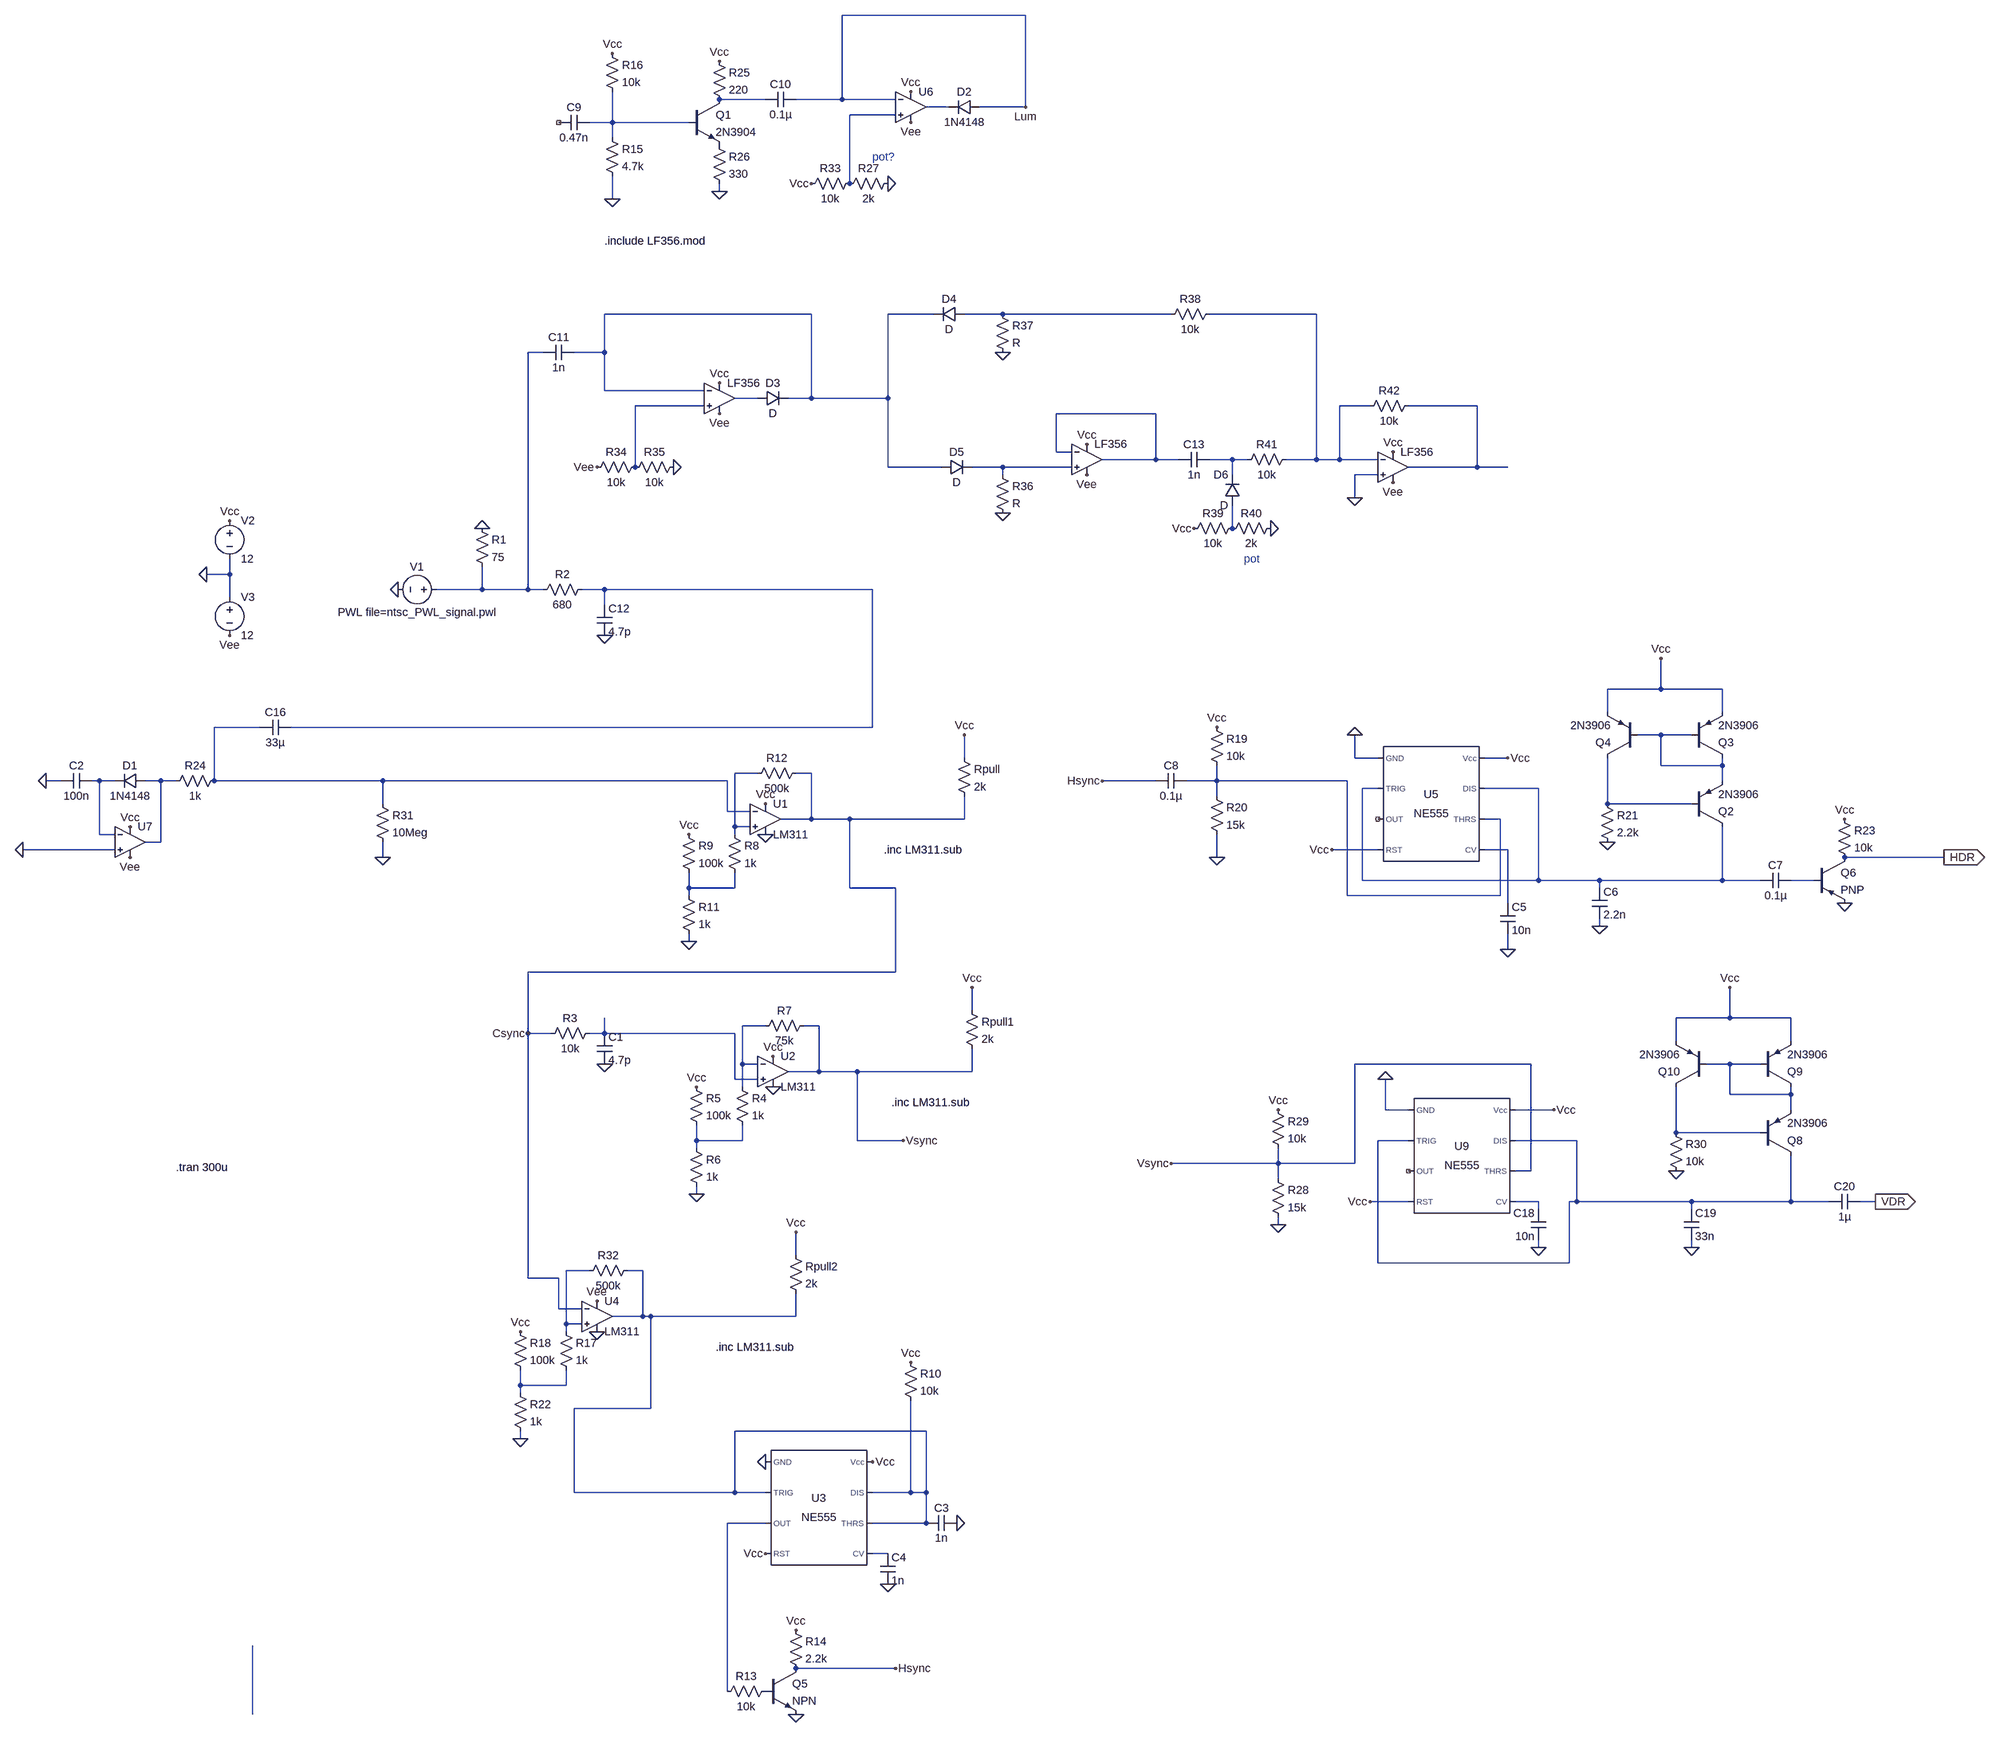
[diagram p0: schematic seventhCircuit(Sync and Ramp Semi finished).asc]
seventhCircuit(Sync and Ramp Semi finished).asc, the LTspice schematic file:
Version 4.1
SHEET 1 4812 2340
WIRE 1296 -1888 912 -1888
WIRE 752 -1712 656 -1712
WIRE 912 -1712 912 -1888
WIRE 912 -1712 816 -1712
WIRE 1024 -1712 912 -1712
WIRE 1136 -1696 1088 -1696
WIRE 1296 -1696 1296 -1888
WIRE 1296 -1696 1200 -1696
WIRE 1024 -1680 928 -1680
WIRE 432 -1664 432 -1728
WIRE 432 -1664 384 -1664
WIRE 592 -1664 432 -1664
WIRE 432 -1632 432 -1664
WIRE 928 -1536 928 -1680
WIRE 656 -1520 656 -1536
WIRE 432 -1504 432 -1552
WIRE 848 -768 416 -768
WIRE 1104 -768 1008 -768
WIRE 1248 -768 1168 -768
WIRE 1600 -768 1248 -768
WIRE 1904 -768 1680 -768
WIRE 288 -688 256 -688
WIRE 416 -688 416 -768
WIRE 416 -688 352 -688
WIRE 416 -608 416 -688
WIRE 624 -608 416 -608
WIRE 736 -592 688 -592
WIRE 848 -592 848 -768
WIRE 848 -592 800 -592
WIRE 1008 -592 1008 -768
WIRE 1008 -592 848 -592
WIRE 624 -576 480 -576
WIRE 2016 -576 1952 -576
WIRE 2240 -576 2096 -576
WIRE 1568 -560 1360 -560
WIRE 1360 -480 1360 -560
WIRE 1392 -480 1360 -480
WIRE 1568 -464 1568 -560
WIRE 1568 -464 1456 -464
WIRE 1616 -464 1568 -464
WIRE 1728 -464 1680 -464
WIRE 1760 -464 1728 -464
WIRE 1904 -464 1904 -768
WIRE 1904 -464 1840 -464
WIRE 1952 -464 1952 -576
WIRE 1952 -464 1904 -464
WIRE 2032 -464 1952 -464
WIRE 480 -448 480 -576
WIRE 1008 -448 1008 -592
WIRE 1120 -448 1008 -448
WIRE 1248 -448 1184 -448
WIRE 1392 -448 1248 -448
WIRE 2240 -448 2240 -576
WIRE 2240 -448 2096 -448
WIRE 2304 -448 2240 -448
WIRE 1248 -432 1248 -448
WIRE 1728 -432 1728 -464
WIRE 2032 -432 1984 -432
WIRE 1984 -384 1984 -432
WIRE 1728 -320 1728 -368
WIRE -368 -224 -368 -256
WIRE -368 -224 -416 -224
WIRE 160 -192 160 -240
WIRE 160 -192 64 -192
WIRE 256 -192 256 -688
WIRE 256 -192 160 -192
WIRE 288 -192 256 -192
WIRE 416 -192 368 -192
WIRE 976 -192 416 -192
WIRE -368 -176 -368 -224
WIRE 416 -160 416 -192
WIRE 2624 16 2624 -48
WIRE 2624 16 2512 16
WIRE 2752 16 2624 16
WIRE 2512 64 2512 16
WIRE 2752 64 2752 16
WIRE -304 96 -400 96
WIRE 976 96 976 -192
WIRE 976 96 -240 96
WIRE 2624 112 2576 112
WIRE 2688 112 2624 112
WIRE 1168 160 1168 112
WIRE 1984 160 1984 112
WIRE 2032 160 1984 160
WIRE 2304 160 2256 160
WIRE 2624 176 2624 112
WIRE 2752 176 2752 160
WIRE 2752 176 2624 176
WIRE 736 192 688 192
WIRE 848 192 816 192
WIRE -720 208 -752 208
WIRE -640 208 -656 208
WIRE -608 208 -640 208
WIRE -512 208 -544 208
WIRE -480 208 -512 208
WIRE -400 208 -400 96
WIRE -48 208 -400 208
WIRE 672 208 -48 208
WIRE 1568 208 1456 208
WIRE 1696 208 1696 176
WIRE 1696 208 1632 208
WIRE 1968 208 1696 208
WIRE 2752 208 2752 176
WIRE 2032 224 2000 224
WIRE 2368 224 2256 224
WIRE 1696 240 1696 208
WIRE -48 256 -48 208
WIRE 2512 256 2512 160
WIRE 2688 256 2512 256
WIRE 672 272 672 208
WIRE 720 272 672 272
WIRE 848 288 848 192
WIRE 848 288 784 288
WIRE 928 288 848 288
WIRE 1168 288 1168 240
WIRE 1168 288 928 288
WIRE 2288 288 2256 288
WIRE 688 304 688 192
WIRE 720 304 688 304
WIRE -640 320 -640 208
WIRE -608 320 -640 320
WIRE 688 320 688 304
WIRE -512 336 -512 208
WIRE -512 336 -544 336
WIRE -608 352 -800 352
WIRE 2032 352 1936 352
WIRE 2304 352 2256 352
WIRE -48 368 -48 336
WIRE 1696 368 1696 320
WIRE 3216 368 3008 368
WIRE 2000 416 2000 224
WIRE 2368 416 2368 224
WIRE 2368 416 2000 416
WIRE 2496 416 2368 416
WIRE 2752 416 2752 304
WIRE 2752 416 2496 416
WIRE 2832 416 2752 416
WIRE 2944 416 2896 416
WIRE 592 432 592 400
WIRE 688 432 688 400
WIRE 688 432 592 432
WIRE 928 432 928 288
WIRE 1024 432 928 432
WIRE 2496 432 2496 416
WIRE 592 448 592 432
WIRE 1968 448 1968 208
WIRE 2288 448 2288 288
WIRE 2288 448 1968 448
WIRE 2304 464 2304 352
WIRE 2496 512 2496 496
WIRE 592 544 592 528
WIRE 2304 560 2304 528
WIRE 1024 608 1024 432
WIRE 1024 608 256 608
WIRE 1184 688 1184 640
WIRE 2768 704 2768 640
WIRE 2768 704 2656 704
WIRE 2896 704 2768 704
WIRE 752 720 704 720
WIRE 864 720 832 720
WIRE 256 736 256 608
WIRE 304 736 256 736
WIRE 416 736 416 704
WIRE 416 736 384 736
WIRE 688 736 416 736
WIRE 2656 752 2656 704
WIRE 2896 752 2896 704
WIRE 704 800 704 720
WIRE 736 800 704 800
WIRE 2352 800 1984 800
WIRE 2768 800 2720 800
WIRE 2832 800 2768 800
WIRE 864 816 864 720
WIRE 864 816 800 816
WIRE 944 816 864 816
WIRE 1184 816 1184 768
WIRE 1184 816 944 816
WIRE 688 832 688 736
WIRE 736 832 688 832
WIRE 704 848 704 800
WIRE 2768 864 2768 800
WIRE 2896 864 2896 848
WIRE 2896 864 2768 864
WIRE 2048 896 2048 832
WIRE 2096 896 2048 896
WIRE 2400 896 2320 896
WIRE 2896 896 2896 864
WIRE 2656 944 2656 848
WIRE 2832 944 2656 944
WIRE 608 960 608 928
WIRE 704 960 704 928
WIRE 704 960 608 960
WIRE 944 960 944 816
WIRE 1040 960 944 960
WIRE 2096 960 2032 960
WIRE 2448 960 2320 960
WIRE 608 976 608 960
WIRE 1824 1008 1824 976
WIRE 1824 1008 1600 1008
WIRE 1984 1008 1984 800
WIRE 1984 1008 1824 1008
WIRE 2352 1024 2352 800
WIRE 2352 1024 2320 1024
WIRE 1824 1040 1824 1008
WIRE 608 1072 608 1056
WIRE 2096 1088 2016 1088
WIRE 2368 1088 2320 1088
WIRE 2448 1088 2448 960
WIRE 2448 1088 2432 1088
WIRE 2688 1088 2448 1088
WIRE 2896 1088 2896 992
WIRE 2896 1088 2688 1088
WIRE 2976 1088 2896 1088
WIRE 3072 1088 3040 1088
WIRE 2368 1104 2368 1088
WIRE 2688 1104 2688 1088
WIRE 1824 1136 1824 1120
WIRE 2368 1184 2368 1168
WIRE 2688 1184 2688 1168
WIRE 816 1200 816 1152
WIRE 2032 1216 2032 960
WIRE 2432 1216 2432 1088
WIRE 2432 1216 2032 1216
WIRE 384 1232 336 1232
WIRE 496 1232 464 1232
WIRE 256 1248 256 736
WIRE 320 1248 256 1248
WIRE 320 1312 320 1248
WIRE 368 1312 320 1312
WIRE 496 1328 496 1232
WIRE 496 1328 432 1328
WIRE 512 1328 496 1328
WIRE 816 1328 816 1280
WIRE 816 1328 512 1328
WIRE 336 1344 336 1232
WIRE 368 1344 336 1344
WIRE 336 1360 336 1344
WIRE 240 1472 240 1440
WIRE 336 1472 336 1440
WIRE 336 1472 240 1472
WIRE 240 1488 240 1472
WIRE 512 1520 512 1328
WIRE 512 1520 352 1520
WIRE 1088 1568 688 1568
WIRE 240 1584 240 1568
WIRE 352 1696 352 1520
WIRE 688 1696 688 1568
WIRE 688 1696 352 1696
WIRE 752 1696 688 1696
WIRE 1056 1696 1056 1504
WIRE 1056 1696 976 1696
WIRE 1088 1696 1088 1568
WIRE 1088 1696 1056 1696
WIRE 752 1760 672 1760
WIRE 1088 1760 1088 1696
WIRE 1088 1760 976 1760
WIRE 1008 1824 976 1824
WIRE 1024 2064 816 2064
WIRE 672 2112 672 1760
WIRE -320 2160 -320 2016
FLAG -16 -192 0
FLAG 160 -320 0
FLAG 1696 96 Vcc
FLAG 1696 368 0
FLAG 1984 112 0
FLAG 2304 560 0
FLAG 2496 512 0
FLAG 2512 336 0
FLAG 3216 368 HDR
IOPIN 3216 368 Out
FLAG 1456 208 Hsync
FLAG 416 -96 0
FLAG 592 544 0
FLAG 752 256 Vcc
FLAG -368 -336 Vcc
FLAG -368 -96 Vee
FLAG -416 -224 0
FLAG 2304 160 Vcc
FLAG 2624 -48 Vcc
FLAG 1936 352 Vcc
FLAG 1168 112 Vcc
FLAG 592 320 Vcc
FLAG 752 320 0
FLAG -48 368 0
FLAG 416 800 0
FLAG -752 208 0
FLAG -576 368 Vee
FLAG -576 304 Vcc
FLAG 608 1072 0
FLAG 768 784 Vcc
FLAG 1184 640 Vcc
FLAG 608 848 Vcc
FLAG 768 848 0
FLAG 1040 960 Vsync
FLAG 1824 1136 0
FLAG 1824 896 Vcc
FLAG 2400 896 Vcc
FLAG 2048 832 0
FLAG 2368 1184 0
FLAG 2016 1088 Vcc
FLAG 2656 1024 0
FLAG 2768 640 Vcc
FLAG 2688 1184 0
FLAG 3072 1088 VDR
IOPIN 3072 1088 Out
FLAG 1600 1008 Vsync
FLAG 240 1584 0
FLAG 400 1296 Vee
FLAG 816 1152 Vcc
FLAG 240 1360 Vcc
FLAG 400 1360 0
FLAG 256 736 Csync
FLAG 752 1632 0
FLAG 976 1632 Vcc
FLAG 752 1824 Vcc
FLAG 1152 1760 0
FLAG 1056 1424 Vcc
FLAG 1008 1888 0
FLAG 816 1984 Vcc
FLAG 816 2160 0
FLAG 1024 2064 Hsync
FLAG 3008 288 Vcc
FLAG 3008 464 0
FLAG 432 -1504 0
FLAG 656 -1792 Vcc
FLAG 656 -1520 0
FLAG 432 -1808 Vcc
FLAG 1056 -1664 Vee
FLAG 1056 -1728 Vcc
FLAG 848 -1536 Vcc
FLAG 1008 -1536 0
FLAG 1296 -1696 Lum
FLAG 656 -624 Vcc
FLAG 656 -560 Vee
FLAG 560 -448 0
FLAG 400 -448 Vee
FLAG 1248 -352 0
FLAG 1248 -688 0
FLAG 1424 -496 Vcc
FLAG 1424 -432 Vee
FLAG 1808 -320 0
FLAG 1648 -320 Vcc
FLAG 2064 -480 Vcc
FLAG 2064 -416 Vee
FLAG 1984 -384 0
FLAG -800 352 0
DATAFLAG 592 432 ""
DATAFLAG 608 960 ""
DATAFLAG 240 1472 ""
SYMBOL voltage 80 -192 R90
WINDOW 0 -32 56 VBottom 2
WINDOW 3 32 56 VTop 2
WINDOW 123 0 0 Left 0
WINDOW 39 0 0 Left 0
SYMATTR InstName V1
SYMATTR Value PWL file=ntsc_PWL_signal.pwl
SYMBOL res 144 -336 R0
SYMATTR InstName R1
SYMATTR Value 75
SYMBOL Misc\\NE555 2144 256 R0
SYMATTR InstName U5
SYMBOL res 1680 80 R0
SYMATTR InstName R19
SYMATTR Value 10k
SYMBOL res 1680 224 R0
SYMATTR InstName R20
SYMATTR Value 15k
SYMBOL cap 2288 464 R0
SYMATTR InstName C5
SYMATTR Value 10n
SYMBOL cap 2480 432 R0
SYMATTR InstName C6
SYMATTR Value 2.2n
SYMBOL cap 2896 400 R90
WINDOW 0 0 32 VBottom 2
WINDOW 3 32 32 VTop 2
SYMATTR InstName C7
SYMATTR Value 0.1µ
SYMBOL pnp 2688 304 M180
SYMATTR InstName Q2
SYMATTR Value 2N3906
SYMBOL pnp 2688 160 M180
SYMATTR InstName Q3
SYMATTR Value 2N3906
SYMBOL pnp 2576 160 R180
SYMATTR InstName Q4
SYMATTR Value 2N3906
SYMBOL res 2496 240 R0
SYMATTR InstName R21
SYMATTR Value 2.2k
SYMBOL cap 1632 192 R90
WINDOW 0 0 32 VBottom 2
WINDOW 3 32 32 VTop 2
SYMATTR InstName C8
SYMATTR Value 0.1µ
SYMBOL res 384 -208 R90
WINDOW 0 0 56 VBottom 2
WINDOW 3 32 56 VTop 2
SYMATTR InstName R2
SYMATTR Value 680
SYMBOL cap 400 -160 R0
SYMATTR InstName C12
SYMATTR Value 4.7p
SYMBOL res 672 304 R0
SYMATTR InstName R8
SYMATTR Value 1k
SYMBOL res 576 304 R0
SYMATTR InstName R9
SYMATTR Value 100k
SYMBOL res 576 432 R0
SYMATTR InstName R11
SYMATTR Value 1k
SYMBOL res 832 176 R90
WINDOW 0 0 56 VBottom 2
WINDOW 3 32 56 VTop 2
SYMATTR InstName R12
SYMATTR Value 500k
SYMBOL res 1152 144 R0
SYMATTR InstName Rpull
SYMATTR Value 2k
SYMBOL voltage -368 -352 R0
SYMATTR InstName V2
SYMATTR Value 12
SYMBOL voltage -368 -192 R0
SYMATTR InstName V3
SYMATTR Value 12
SYMBOL OpAmps\\opamp2 752 224 R0
SYMATTR InstName U1
SYMATTR Value LM311
SYMBOL res -64 240 R0
SYMATTR InstName R31
SYMATTR Value 10Meg
SYMBOL res 400 720 R90
WINDOW 0 0 56 VBottom 2
WINDOW 3 32 56 VTop 2
SYMATTR InstName R3
SYMATTR Value 10k
SYMBOL cap 400 736 R0
SYMATTR InstName C1
SYMATTR Value 4.7p
SYMBOL res -384 192 R90
WINDOW 0 0 56 VBottom 2
WINDOW 3 32 56 VTop 2
SYMATTR InstName R24
SYMATTR Value 1k
SYMBOL diode -544 192 R90
WINDOW 0 0 32 VBottom 2
WINDOW 3 32 32 VTop 2
SYMATTR InstName D1
SYMATTR Value 1N4148
SYMBOL cap -656 192 R90
WINDOW 0 0 32 VBottom 2
WINDOW 3 32 32 VTop 2
SYMATTR InstName C2
SYMATTR Value 100n
SYMBOL OpAmps\\UniversalOpAmp2 -576 336 R0
SYMATTR InstName U7
SYMBOL cap -240 80 R90
WINDOW 0 0 32 VBottom 2
WINDOW 3 32 32 VTop 2
SYMATTR InstName C16
SYMATTR Value 33µ
SYMBOL res 688 832 R0
SYMATTR InstName R4
SYMATTR Value 1k
SYMBOL res 592 832 R0
SYMATTR InstName R5
SYMATTR Value 100k
SYMBOL res 592 960 R0
SYMATTR InstName R6
SYMATTR Value 1k
SYMBOL res 848 704 R90
WINDOW 0 0 56 VBottom 2
WINDOW 3 32 56 VTop 2
SYMATTR InstName R7
SYMATTR Value 75k
SYMBOL res 1168 672 R0
SYMATTR InstName Rpull1
SYMATTR Value 2k
SYMBOL OpAmps\\opamp2 768 752 R0
SYMATTR InstName U2
SYMATTR Value LM311
SYMBOL res 1808 1024 R0
SYMATTR InstName R28
SYMATTR Value 15k
SYMBOL res 1808 880 R0
SYMATTR InstName R29
SYMATTR Value 10k
SYMBOL Misc\\NE555 2208 992 R0
SYMATTR InstName U9
SYMBOL cap 2384 1168 R180
WINDOW 0 24 56 Left 2
WINDOW 3 24 8 Left 2
SYMATTR InstName C18
SYMATTR Value 10n
SYMBOL pnp 2832 992 M180
SYMATTR InstName Q8
SYMATTR Value 2N3906
SYMBOL pnp 2832 848 M180
SYMATTR InstName Q9
SYMATTR Value 2N3906
SYMBOL pnp 2720 848 R180
SYMATTR InstName Q10
SYMATTR Value 2N3906
SYMBOL res 2640 928 R0
SYMATTR InstName R30
SYMATTR Value 10k
SYMBOL cap 2672 1104 R0
SYMATTR InstName C19
SYMATTR Value 33n
SYMBOL cap 3040 1072 R90
WINDOW 0 0 32 VBottom 2
WINDOW 3 32 32 VTop 2
SYMATTR InstName C20
SYMATTR Value 1µ
SYMBOL res 320 1344 R0
SYMATTR InstName R17
SYMATTR Value 1k
SYMBOL res 224 1344 R0
SYMATTR InstName R18
SYMATTR Value 100k
SYMBOL res 224 1472 R0
SYMATTR InstName R22
SYMATTR Value 1k
SYMBOL res 480 1216 R90
WINDOW 0 0 56 VBottom 2
WINDOW 3 32 56 VTop 2
SYMATTR InstName R32
SYMATTR Value 500k
SYMBOL res 800 1184 R0
SYMATTR InstName Rpull2
SYMATTR Value 2k
SYMBOL OpAmps\\opamp2 400 1264 R0
SYMATTR InstName U4
SYMATTR Value LM311
SYMBOL Misc\\NE555 864 1728 R0
SYMATTR InstName U3
SYMBOL cap 1152 1744 R90
WINDOW 0 0 32 VBottom 2
WINDOW 3 32 32 VTop 2
SYMATTR InstName C3
SYMATTR Value 1n
SYMBOL res 1040 1408 R0
SYMATTR InstName R10
SYMATTR Value 10k
SYMBOL cap 992 1824 R0
SYMATTR InstName C4
SYMATTR Value 1n
SYMBOL res 768 2096 R90
WINDOW 0 0 56 VBottom 2
WINDOW 3 32 56 VTop 2
SYMATTR InstName R13
SYMATTR Value 10k
SYMBOL npn 752 2064 R0
SYMATTR InstName Q5
SYMBOL res 800 1968 R0
SYMATTR InstName R14
SYMATTR Value 2.2k
SYMBOL res 2992 272 R0
SYMATTR InstName R23
SYMATTR Value 10k
SYMBOL pnp 2944 368 R0
SYMATTR InstName Q6
SYMBOL cap 384 -1680 R90
WINDOW 0 0 32 VBottom 2
WINDOW 3 32 32 VTop 2
SYMATTR InstName C9
SYMATTR Value 0.47n
SYMBOL res 416 -1648 R0
SYMATTR InstName R15
SYMATTR Value 4.7k
SYMBOL res 416 -1824 R0
SYMATTR InstName R16
SYMATTR Value 10k
SYMBOL npn 592 -1712 R0
SYMATTR InstName Q1
SYMATTR Value 2N3904
SYMBOL res 640 -1808 R0
SYMATTR InstName R25
SYMATTR Value 220
SYMBOL cap 816 -1728 R90
WINDOW 0 0 32 VBottom 2
WINDOW 3 32 32 VTop 2
SYMATTR InstName C10
SYMATTR Value 0.1µ
SYMBOL res 640 -1632 R0
SYMATTR InstName R26
SYMATTR Value 330
SYMBOL OpAmps\\UniversalOpAmp2 1056 -1696 R0
SYMATTR InstName U6
SYMBOL diode 1200 -1712 R90
WINDOW 0 0 32 VBottom 2
WINDOW 3 32 32 VTop 2
SYMATTR InstName D2
SYMATTR Value 1N4148
SYMBOL res 1024 -1552 R90
WINDOW 0 0 56 VBottom 2
WINDOW 3 32 56 VTop 2
SYMATTR InstName R27
SYMATTR Value 2k
SYMBOL res 944 -1552 R90
WINDOW 0 0 56 VBottom 2
WINDOW 3 32 56 VTop 2
SYMATTR InstName R33
SYMATTR Value 10k
SYMBOL cap 352 -704 R90
WINDOW 0 0 32 VBottom 2
WINDOW 3 32 32 VTop 2
SYMATTR InstName C11
SYMATTR Value 1n
SYMBOL OpAmps\\UniversalOpAmp2 656 -592 R0
SYMATTR InstName LF356
SYMBOL res 496 -464 R90
WINDOW 0 0 56 VBottom 2
WINDOW 3 32 56 VTop 2
SYMATTR InstName R34
SYMATTR Value 10k
SYMBOL res 576 -464 R90
WINDOW 0 0 56 VBottom 2
WINDOW 3 32 56 VTop 2
SYMATTR InstName R35
SYMATTR Value 10k
SYMBOL diode 736 -576 R270
WINDOW 0 32 32 VTop 2
WINDOW 3 0 32 VBottom 2
SYMATTR InstName D3
SYMBOL diode 1168 -784 R90
WINDOW 0 0 32 VBottom 2
WINDOW 3 32 32 VTop 2
SYMATTR InstName D4
SYMBOL diode 1120 -432 R270
WINDOW 0 32 32 VTop 2
WINDOW 3 0 32 VBottom 2
SYMATTR InstName D5
SYMBOL res 1232 -448 R0
SYMATTR InstName R36
SYMBOL res 1232 -784 R0
SYMATTR InstName R37
SYMBOL OpAmps\\UniversalOpAmp2 1424 -464 R0
SYMATTR InstName LF356
SYMBOL cap 1680 -480 R90
WINDOW 0 0 32 VBottom 2
WINDOW 3 32 32 VTop 2
SYMATTR InstName C13
SYMATTR Value 1n
SYMBOL res 1696 -784 R90
WINDOW 0 0 56 VBottom 2
WINDOW 3 32 56 VTop 2
SYMATTR InstName R38
SYMATTR Value 10k
SYMBOL diode 1744 -368 R180
WINDOW 0 24 64 Left 2
WINDOW 3 24 0 Left 2
SYMATTR InstName D6
SYMBOL res 1744 -336 R90
WINDOW 0 0 56 VBottom 2
WINDOW 3 32 56 VTop 2
SYMATTR InstName R39
SYMATTR Value 10k
SYMBOL res 1824 -336 R90
WINDOW 0 0 56 VBottom 2
WINDOW 3 32 56 VTop 2
SYMATTR InstName R40
SYMATTR Value 2k
SYMBOL res 1856 -480 R90
WINDOW 0 0 56 VBottom 2
WINDOW 3 32 56 VTop 2
SYMATTR InstName R41
SYMATTR Value 10k
SYMBOL OpAmps\\UniversalOpAmp2 2064 -448 R0
SYMATTR InstName LF356
SYMBOL res 2112 -592 R90
WINDOW 0 0 56 VBottom 2
WINDOW 3 32 56 VTop 2
SYMATTR InstName R42
SYMATTR Value 10k
TEXT -480 1016 Left 2 !.tran 300u
TEXT 1000 352 Left 2 !.inc LM311.sub
TEXT 1016 880 Left 2 !.inc LM311.sub
TEXT 648 1392 Left 2 !.inc LM311.sub
TEXT 976 -1592 Left 2 ;pot?
TEXT 416 -1416 Left 2 !.include LF356.mod
TEXT 1752 -256 Left 2 ;pot

The netlist it stands for:
* seventhCircuit(Sync and Ramp Semi finished).asc
V1 N008 0 PWL file=ntsc_PWL_signal.pwl
R1 0 N008 75
X§U5 0 N023 NC_01 Vcc N025 N022 N023 Vcc NE555  ; pins GND TRIG OUT RST CV THRS DIS Vcc
R19 Vcc N022 10k
R20 N022 0 15k
C5 N025 0 10n
C6 N023 0 2.2n
C7 N026 N023 0.1µ
Q2 N023 N024 N018 0 2N3906
Q3 N018 N018 Vcc 0 2N3906
Q4 N024 N018 Vcc 0 2N3906
R21 N024 0 2.2k
C8 N022 Hsync 0.1µ
R2 N016 N008 680
C12 N016 0 4.7p
R8 N019 N027 1k
R9 Vcc N027 100k
R11 N027 0 1k
R12 Csync N019 500k
Rpull Vcc Csync 2k
V2 Vcc 0 12
V3 0 Vee 12
X§U1 N019 N017 Vcc 0 Csync LM311  ; pins In+ In- V+ V- OUT
R31 N017 0 10Meg
R3 N029 Csync 10k
C1 N029 0 4.7p
R24 N017 N021 1k
D1 N021 N020 1N4148
C2 N020 0 100n
X§U7 0 N020 Vcc Vee N021 level2 Avol=1Meg GBW=10Meg Slew=10Meg Ilimit=25m Rail=0 Vos=0 En=0 Enk=0 In=0 Ink=0 Rin=500Meg  ; pins In+ In- V+ V- OUT
C16 N016 N017 33µ
R4 N028 N032 1k
R5 Vcc N032 100k
R6 N032 0 1k
R7 Vsync N028 75k
Rpull1 Vcc Vsync 2k
X§U2 N029 N028 Vcc 0 Vsync LM311  ; pins In+ In- V+ V- OUT
R28 Vsync 0 15k
R29 Vcc Vsync 10k
X§U9 0 N033 NC_02 Vcc N034 Vsync N033 Vcc NE555  ; pins GND TRIG OUT RST CV THRS DIS Vcc
C18 0 N034 10n
Q8 N033 N031 N030 0 2N3906
Q9 N030 N030 Vcc 0 2N3906
Q10 N031 N030 Vcc 0 2N3906
R30 N031 0 10k
C19 N033 0 33n
C20 VDR N033 1µ
R17 N035 N037 1k
R18 Vcc N037 100k
R22 N037 0 1k
R32 N036 N035 500k
Rpull2 Vcc N036 2k
X§U4 N035 Csync Vee 0 N036 LM311  ; pins In+ In- V+ V- OUT
X§U3 0 N036 N038 Vcc N039 N036 N036 Vcc NE555  ; pins GND TRIG OUT RST CV THRS DIS Vcc
C3 0 N036 1n
R10 Vcc N036 10k
C4 N039 0 1n
R13 P001 N038 10k
Q5 Hsync P001 0 0 NPN
R14 Vcc Hsync 2.2k
R23 Vcc HDR 10k
Q6 HDR N026 0 0 PNP
C9 N004 NC_03 0.47n
R15 N004 0 4.7k
R16 Vcc N004 10k
Q1 N001 N004 P002 0 2N3904
R25 Vcc N001 220
C10 Lum N001 0.1µ
R26 P002 0 330
X§U6 N003 Lum Vcc Vee N002 level2 Avol=1Meg GBW=10Meg Slew=10Meg Ilimit=25m Rail=0 Vos=0 En=0 Enk=0 In=0 Ink=0 Rin=500Meg  ; pins In+ In- V+ V- OUT
D2 Lum N002 1N4148
R27 0 N003 2k
R33 N003 Vcc 10k
C11 N005 N008 1n
X§LF356 N010 N005 Vcc Vee N009 level2 Avol=1Meg GBW=10Meg Slew=10Meg Ilimit=25m Rail=0 Vos=0 En=0 Enk=0 In=0 Ink=0 Rin=500Meg  ; pins In+ In- V+ V- OUT
R34 N010 Vee 10k
R35 0 N010 10k
D3 N009 N005 D
D4 N006 N005 D
D5 N005 N014 D
R36 N014 0 R
R37 N006 0 R
X§LF356 N014 N012 Vcc Vee N012 level2 Avol=1Meg GBW=10Meg Slew=10Meg Ilimit=25m Rail=0 Vos=0 En=0 Enk=0 In=0 Ink=0 Rin=500Meg  ; pins In+ In- V+ V- OUT
C13 N013 N012 1n
R38 N007 N006 10k
D6 N015 N013 D
R39 N015 Vcc 10k
R40 0 N015 2k
R41 N007 N013 10k
X§LF356 0 N007 Vcc Vee N011 level2 Avol=1Meg GBW=10Meg Slew=10Meg Ilimit=25m Rail=0 Vos=0 En=0 Enk=0 In=0 Ink=0 Rin=500Meg  ; pins In+ In- V+ V- OUT
R42 N011 N007 10k
.model D D
.lib standard.dio
.model NPN NPN
.model PNP PNP
.lib standard.bjt
.tran 300u
.inc LM311.sub
.inc LM311.sub
.inc LM311.sub
* pot?
.include LF356.mod
* pot
.lib NE555.sub
.lib UniversalOpAmp2.lib
.backanno
.end